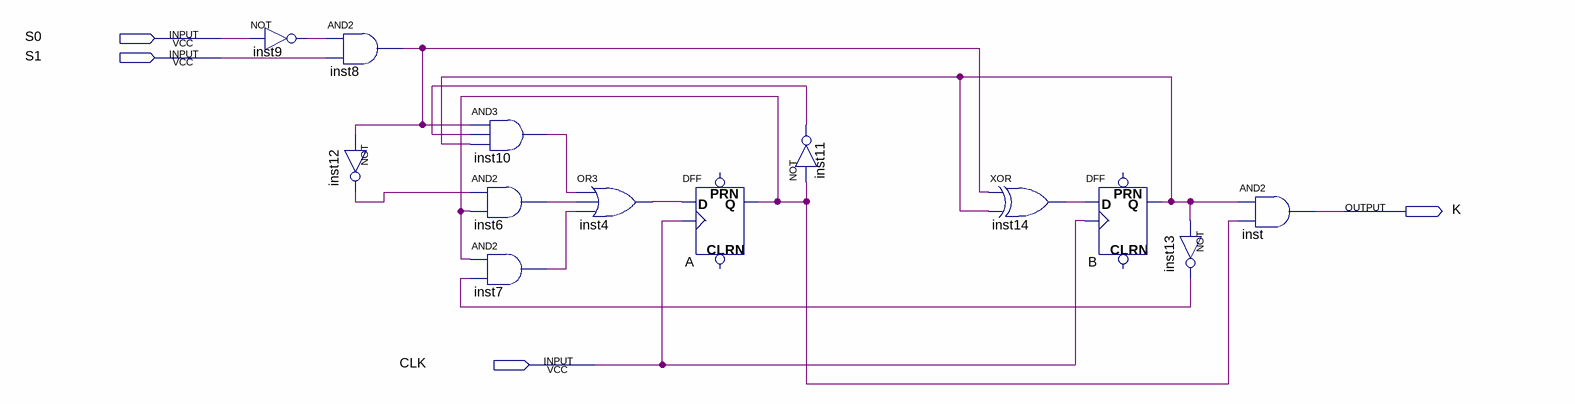
[diagram p0: schematic sheet]
// Quartus schematic contador(k).bdf as structural Verilog: 13 symbols, 4 pins
module \contador(k)  (
  input  S0,
  input  S1,
  input  CLK,
  output K
);

  wire A_q, B_q, inst4_out, inst6_out, inst7_out, inst8_out, inst9_out, inst10_out, inst11_out, inst12_out,
       inst13_out, inst14_out;

  not inst9 (inst9_out, S0);
  and inst8 (inst8_out, inst9_out, S1);
  not inst12 (inst12_out, inst8_out);
  and inst10 (inst10_out, inst8_out, inst11_out, B_q);
  and inst6 (inst6_out, inst12_out, A_q);
  and inst7 (inst7_out, A_q, inst13_out);
  or inst4 (inst4_out, inst10_out, inst6_out, inst7_out);
  DFF A (.CLK(CLK), .D(inst4_out), .Q(A_q));  // open: CLRN, PRN
  not inst11 (inst11_out, A_q);
  xor inst14 (inst14_out, inst8_out, B_q);
  DFF B (.CLK(CLK), .D(inst14_out), .Q(B_q));  // open: CLRN, PRN
  not inst13 (inst13_out, B_q);
  and inst (K, B_q, A_q);
endmodule
